# EAGLE design ROM_1_0 (EAGLE 8.3.2)
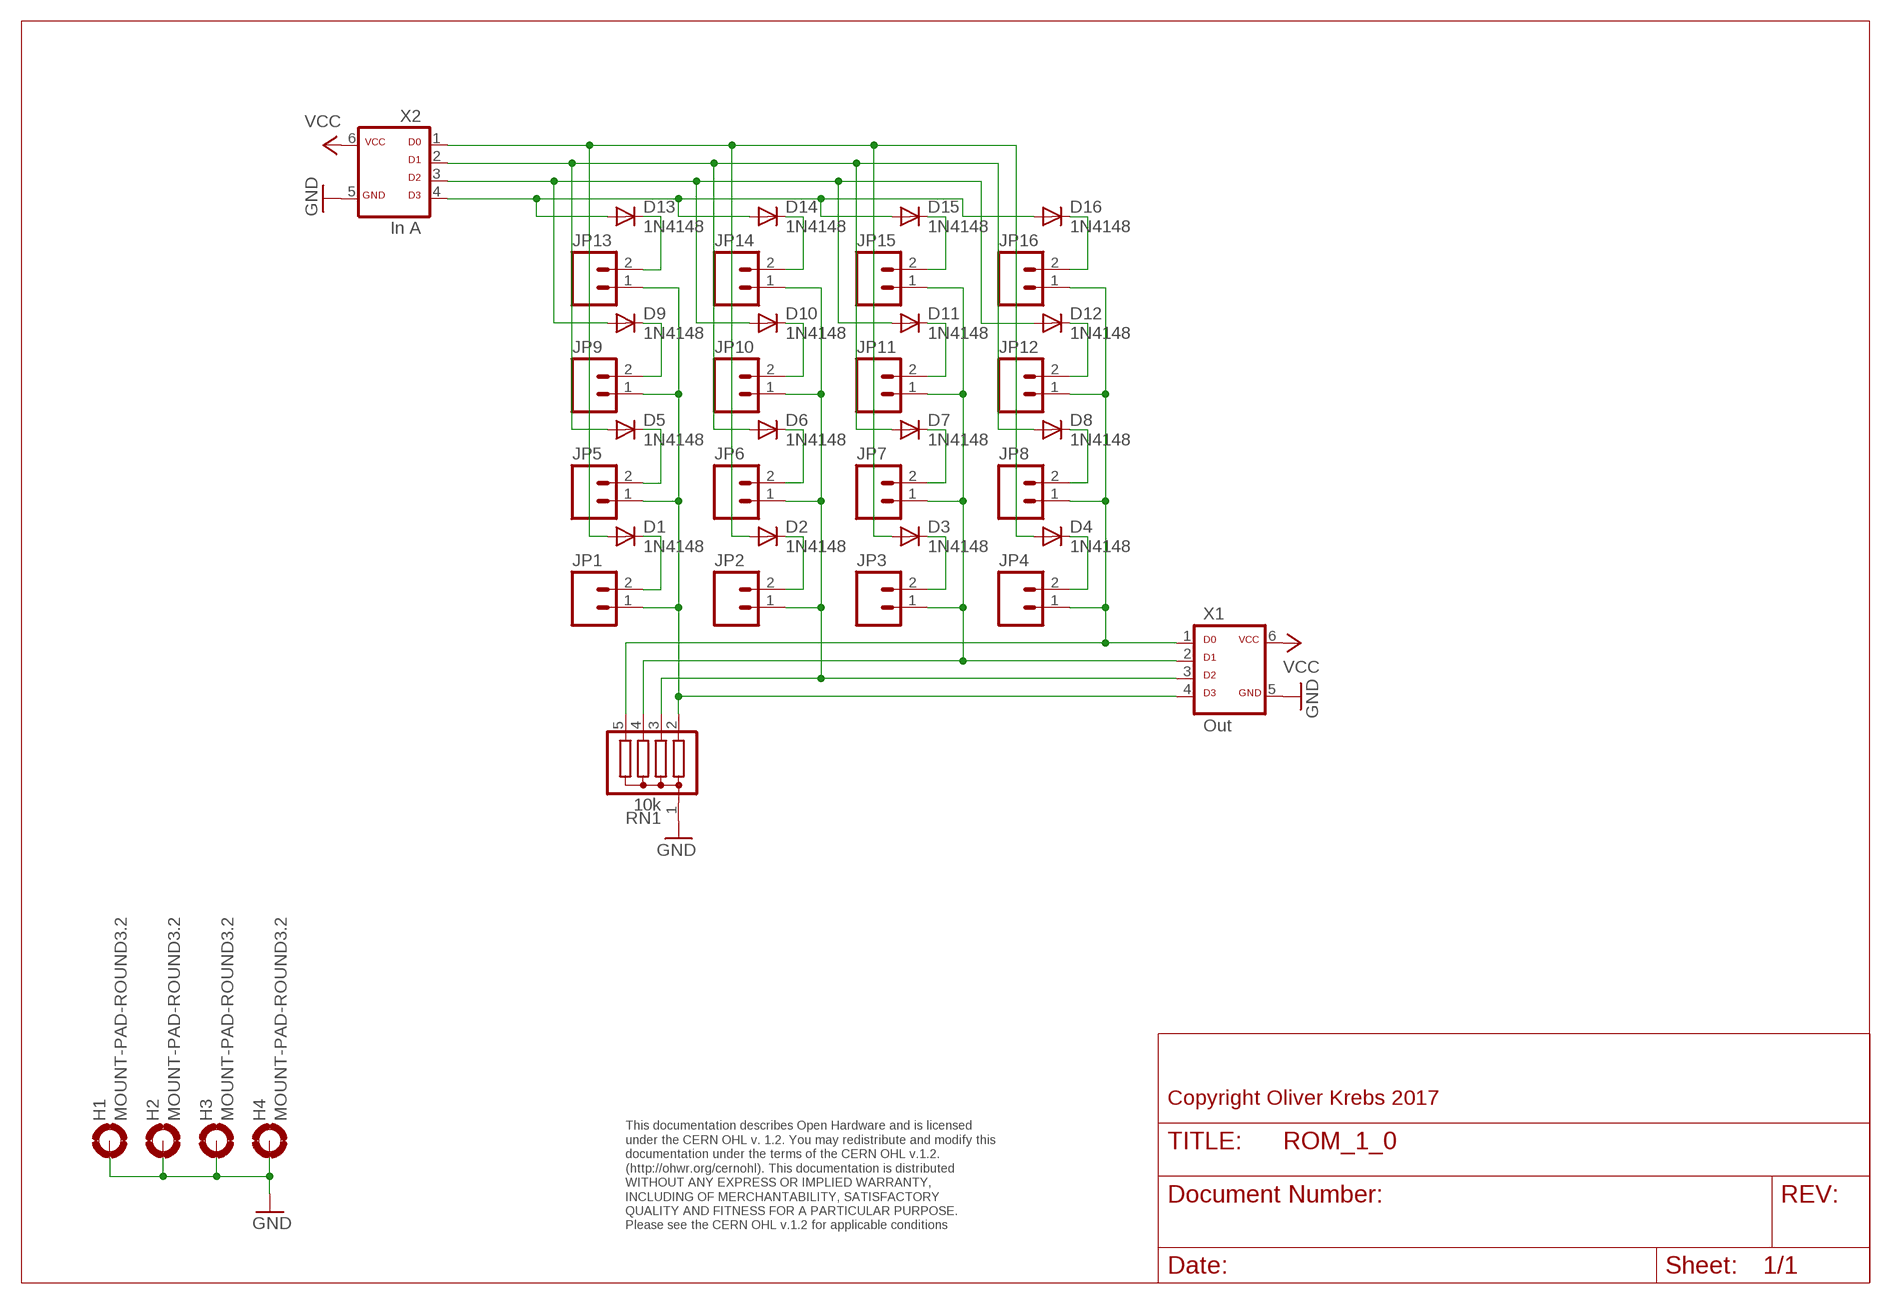
[diagram p0: schematic, sheet 1]

## Parts
D1  1N4148  1N4148DO35-7  [DO35-7]
D2  1N4148  1N4148DO35-7  [DO35-7]
D3  1N4148  1N4148DO35-7  [DO35-7]
D4  1N4148  1N4148DO35-7  [DO35-7]
D5  1N4148  1N4148DO35-7  [DO35-7]
D6  1N4148  1N4148DO35-7  [DO35-7]
D7  1N4148  1N4148DO35-7  [DO35-7]
D8  1N4148  1N4148DO35-7  [DO35-7]
D9  1N4148  1N4148DO35-7  [DO35-7]
D10  1N4148  1N4148DO35-7  [DO35-7]
D11  1N4148  1N4148DO35-7  [DO35-7]
D12  1N4148  1N4148DO35-7  [DO35-7]
D13  1N4148  1N4148DO35-7  [DO35-7]
D14  1N4148  1N4148DO35-7  [DO35-7]
D15  1N4148  1N4148DO35-7  [DO35-7]
D16  1N4148  1N4148DO35-7  [DO35-7]
H1  MOUNT-PAD-ROUND3.2  [3,2-PAD]
H2  MOUNT-PAD-ROUND3.2  [3,2-PAD]
H3  MOUNT-PAD-ROUND3.2  [3,2-PAD]
H4  MOUNT-PAD-ROUND3.2  [3,2-PAD]
JP1  M02PTH  [1X02]
JP2  M02PTH  [1X02]
JP3  M02PTH  [1X02]
JP4  M02PTH  [1X02]
JP5  M02PTH  [1X02]
JP6  M02PTH  [1X02]
JP7  M02PTH  [1X02]
JP8  M02PTH  [1X02]
JP9  M02PTH  [1X02]
JP10  M02PTH  [1X02]
JP11  M02PTH  [1X02]
JP12  M02PTH  [1X02]
JP13  M02PTH  [1X02]
JP14  M02PTH  [1X02]
JP15  M02PTH  [1X02]
JP16  M02PTH  [1X02]
RN1  10k  G04R  [SIL5]
X1  Out  ML6D  [ML-6]
X2  In A  ML6D  [ML-6]

## Nets
GND: H1.B3,2(MOUNT) H2.B3,2(MOUNT) H3.B3,2(MOUNT) H4.B3,2(MOUNT) RN1.1 X1.5 X2.5
N$1: JP4.1 JP8.1 JP12.1 JP16.1 RN1.5 X1.1
N$2: JP3.1 JP7.1 JP11.1 JP15.1 RN1.4 X1.2
N$3: JP2.1 JP6.1 JP10.1 JP14.1 RN1.3 X1.3
N$4: JP1.1 JP5.1 JP9.1 JP13.1 RN1.2 X1.4
N$5: D1.A D2.A D3.A D4.A X2.1
N$6: D1.C JP1.2
N$7: D2.C JP2.2
N$8: D3.C JP3.2
N$9: D4.C JP4.2
N$10: D5.A D6.A D7.A D8.A X2.2
N$11: D6.C JP6.2
N$12: D7.C JP7.2
N$14: D5.C JP5.2
N$15: D8.C JP8.2
N$16: D9.C JP9.2
N$17: D10.C JP10.2
N$18: D11.C JP11.2
N$19: D12.C JP12.2
N$20: D9.A D10.A D11.A D12.A X2.3
N$21: D13.A D14.A D15.A D16.A X2.4
N$22: D13.C JP13.2
N$23: D14.C JP14.2
N$24: D15.C JP15.2
N$25: D16.C JP16.2
VCC: X1.6 X2.6

## Notes on the sheet
- Copyright Oliver Krebs 2017
- This documentation describes Open Hardware and is licensed 
  under the CERN OHL v. 1.2. You may redistribute and modify this 
  documentation under the terms of the CERN OHL v.1.2. 
  (http://ohwr.org/cernohl). This documentation is distributed
  WITHOUT ANY EXPRESS OR IMPLIED WARRANTY, 
  INCLUDING OF MERCHANTABILITY, SATISFACTORY 
  QUALITY AND FITNESS FOR A PARTICULAR PURPOSE. 
  Please see the CERN OHL v.1.2 for applicable conditions

## Library data of the parts
D1-D16 = 01-my-diode:1N4148: DIODE high speed (Philips)
H1-H4 = holes:MOUNT-PAD-ROUND: MOUNTING PAD, round
JP1-JP16 = SparkFun-Connectors:M02: Standard 2-pin 0.1" header. Use with - straight break away headers ( PRT-00116) - right angle break away headers (PRT-00553) - swiss pins (PRT-00743) - machine pins (PRT-00117) - female headers (PRT-00115) Molex polarized connector foot print use with: PRT-08233 with associated crimp pins and housings. 2.54_SCREWTERM for use with PRT-10571. 3.5mm Screw Terminal footprints for PRT-08084 5mm Screw Terminal footprints for use with PRT-08432
RN1 = resistor-sil:G04R: SIL RESISTOR; OC_FARNELL: unknown; OC_NEWARK: unknown
X1 X2 = 01-my-con:ML6D

## Board
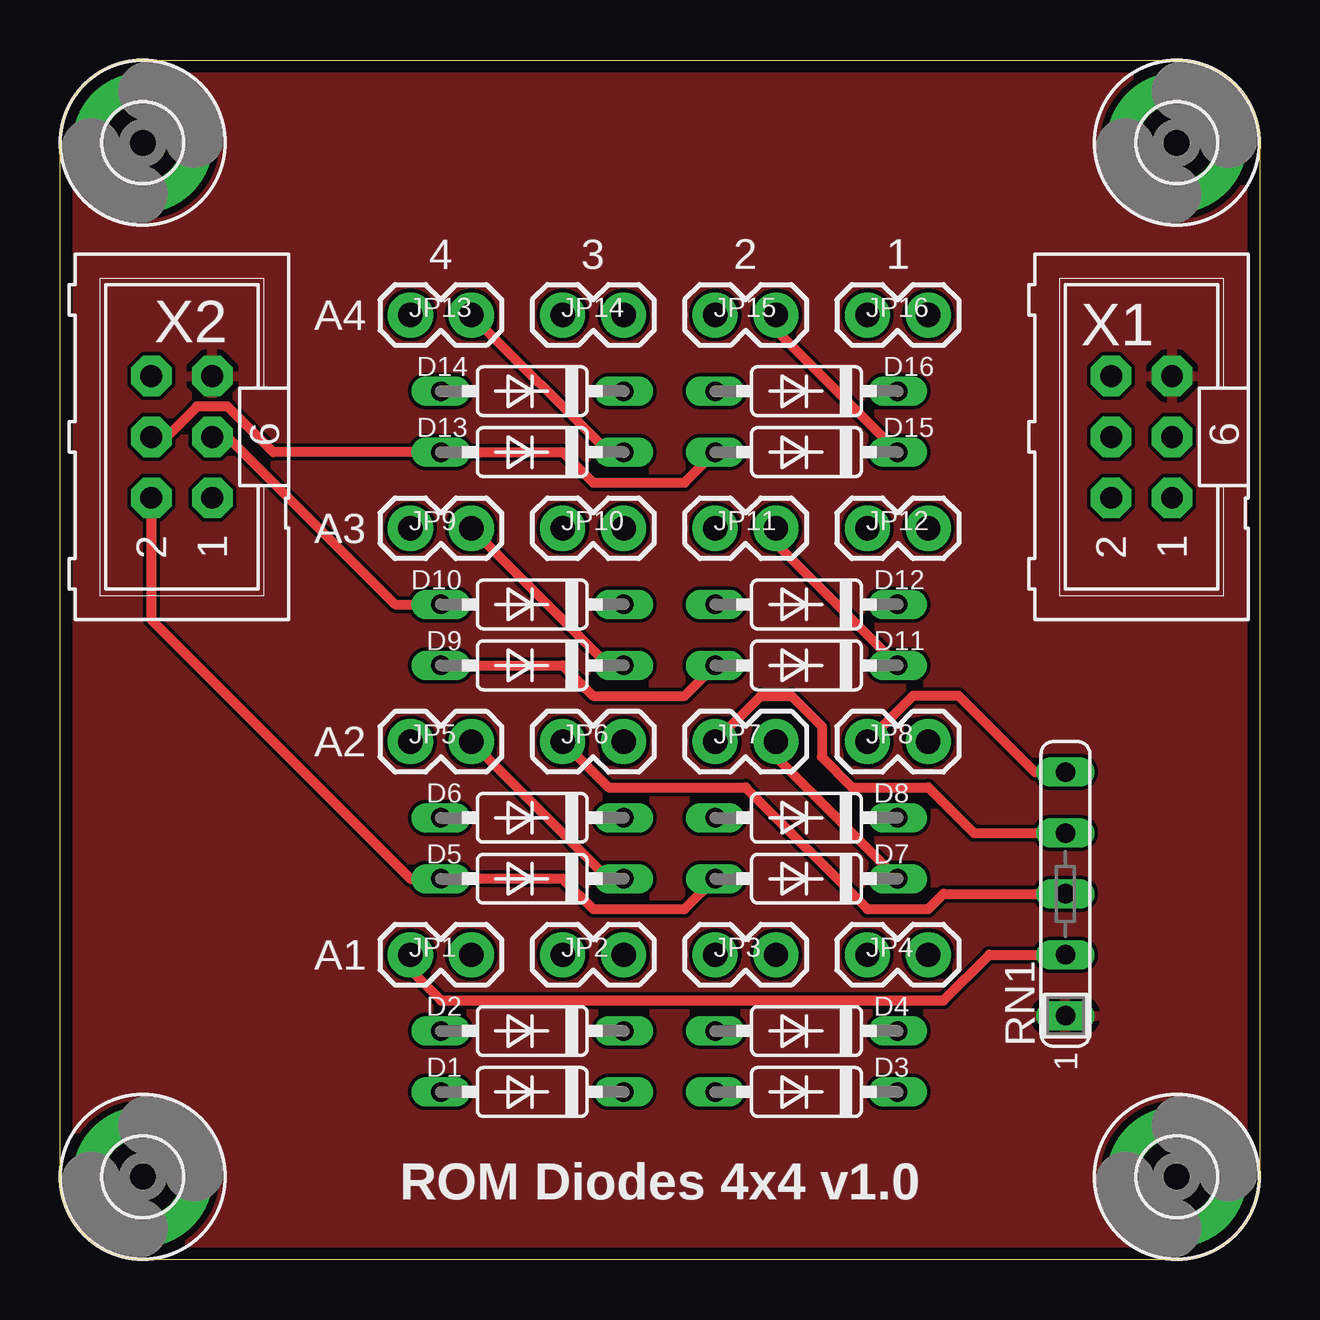
[diagram p1: board, top side]
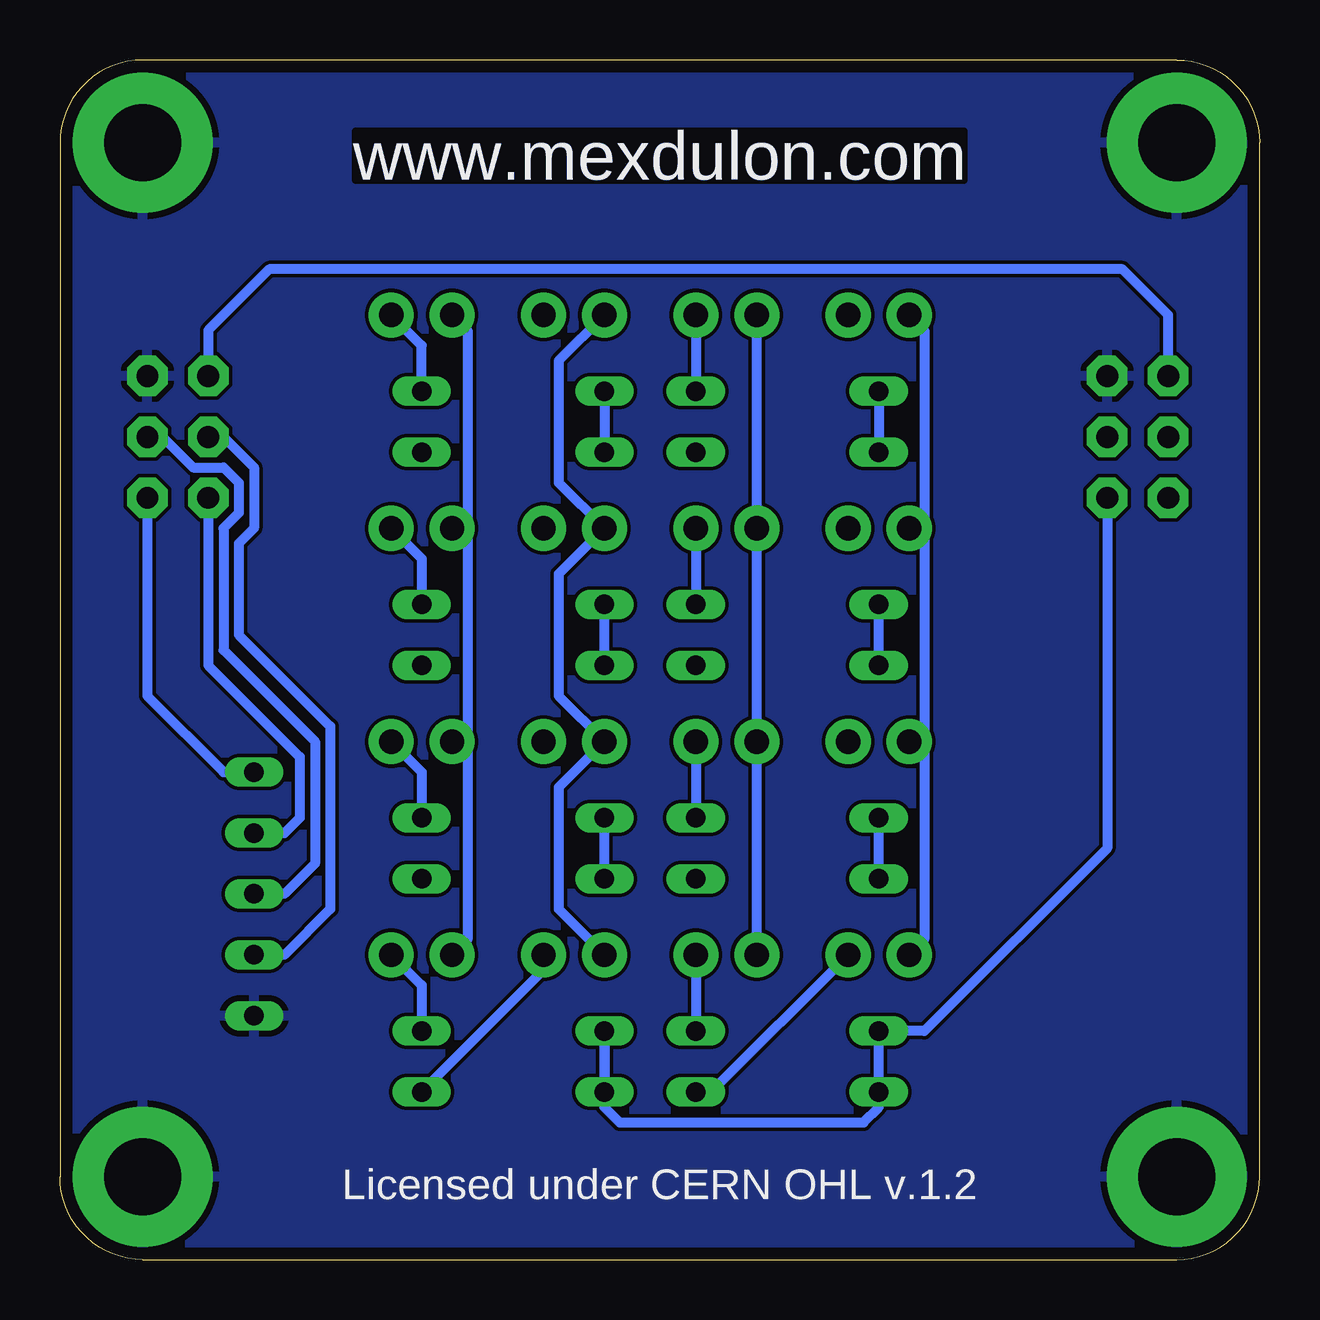
[diagram p2: board, bottom side, seen from below]

Size 50 x 50 mm. Coordinates in mm from the lower left corner, seen from the top.
Outline: 0,3.45 0,46.55 arc-90 3.45,50 46.55,50 arc-90 50,46.55 50,3.45 arc-90 46.55,0 3.45,0 arc-90 0,3.45
Copper layers (1*16): Top 0.035mm / dielectric 1.6mm / Bottom 0.035mm
Design rules "Elecrow_2-layer_PCB_eagle_rule": minimum track width 6mil, minimum drill 12mil, track to track 6mil, track to pad 6mil, pad to pad 6mil, via to via 8mil, smd to smd 0mil, copper to edge 20mil, drill to drill 10mil, minimum pad ring 6mil, minimum via ring 6mil, stop-mask expansion 0mil, vias tented up to drill 100mil, thermal gap 10mil

### Footprints (pad centres in the part's own frame; a part is rotated, then mirrored left to right if it is on the bottom)
DO35-7 = drill 0.813 long: A 3.81,0; C -3.81,0
3,2-PAD = drill 3.2 pad 5.842: B3,2 0,0
1X02 = drill 1.016 pad 1.88: 1 0,0; 2 2.54,0
SIL5 = drill 0.813 long: 1 -5.08,0; 2 -2.54,0; 3 0,0; 4 2.54,0; 5 5.08,0
ML-6 = drill 0.914 pad 1.676 octagon: 1 -2.54,-1.27; 2 -2.54,1.27; 3 0,-1.27; 4 0,1.27; 5 2.54,-1.27; 6 2.54,1.27

### Placement (x,y rotation side)
D1  19.68,6.99 180 top
D2  19.68,9.53 180 top
D3  31.11,6.99 180 top
D4  31.11,9.53 180 top
D5  19.68,15.88 180 top
D6  19.68,18.41 180 top
D7  31.11,15.88 180 top
D8  31.11,18.41 180 top
D9  19.68,24.77 180 top
D10  19.68,27.3 180 top
D11  31.11,24.77 180 top
D12  31.11,27.3 180 top
D13  19.68,33.66 180 top
D14  19.68,36.2 180 top
D15  31.11,33.66 180 top
D16  31.11,36.2 180 top
H1  3.45,3.45 0 top
H2  3.45,46.55 0 top
H3  46.55,3.45 0 top
H4  46.55,46.55 0 top
JP1  14.61,12.7 0 top
JP2  20.95,12.7 0 top
JP3  27.3,12.7 0 top
JP4  33.66,12.7 0 top
JP5  14.61,21.59 0 top
JP6  20.95,21.59 0 top
JP7  27.3,21.59 0 top
JP8  33.66,21.59 0 top
JP9  14.61,30.48 0 top
JP10  20.95,30.48 0 top
JP11  27.3,30.48 0 top
JP12  33.66,30.48 0 top
JP13  14.61,39.37 0 top
JP14  20.95,39.37 0 top
JP15  27.3,39.37 0 top
JP16  33.66,39.37 0 top
RN1  41.91,15.24 90 top
X1  45.09,34.29 90 top
X2  5.08,34.29 90 top

### Tracks (layer width: path | path; a pad name or v marks a point on that pad's centre or on a via)
GND
  pour Bottom: 0,0 50.8,0 50.8,50.8 0,50.8
  pour Top: 0,50.16 50.16,50.16 50.16,0 0,0
N$1
  Top 0.406: RN1.5 40.64,20.32 37.47,23.5 35.56,23.5 JP8.1
  Bottom 0.406: 33.02,30.48 33.02,21.59 | 33.02,21.59 33.02,13.34 JP4.1 | JP8.1 33.02,21.59 | JP12.1 33.02,30.48 | X1.1 46.35,23.5 43.18,20.32 RN1.5 | JP16.1 33.02,38.73 33.02,30.48
N$2
  Top 0.406: JP7.1 29.21,23.5 30.48,23.5 31.75,22.23 31.75,20.95 33.02,19.68 36.2,19.68 38.1,17.78 RN1.4
  Bottom 0.406: JP3.1 29.21,14.61 29.21,19.68 JP7.1 29.21,23.5 29.21,28.57 JP11.1 29.21,32.38 29.21,37.47 JP15.1 | X1.2 43.81,24.77 40.01,20.95 40.01,18.41 40.64,17.78 RN1.4
N$3
  Top 0.406: JP6.1 22.86,19.68 28.57,19.68 33.66,14.61 36.2,14.61 36.83,15.24 RN1.3
  Bottom 0.406: JP2.1 JP6.1 JP10.1 JP14.1 | X1.3 45.72,34.29 44.45,33.02 43.18,33.02 42.55,32.38 42.55,31.11 43.18,30.48 43.18,25.4 39.37,21.59 39.37,16.51 40.64,15.24 RN1.3
N$4
  Top 0.406: RN1.2 38.73,12.7 36.83,10.79 15.88,10.79 14.61,12.06 JP1.1
  Bottom 0.406: 13.97,30.48 13.97,21.59 | 13.97,21.59 13.97,13.34 JP1.1 | JP5.1 13.97,21.59 | JP9.1 13.97,30.48 | X1.4 43.18,34.29 41.91,33.02 41.91,30.48 42.55,29.84 42.55,26.04 38.73,22.23 38.73,14.61 40.64,12.7 RN1.2 | JP13.1 13.97,38.73 13.97,30.48
N$5
  Bottom 0.406: D3.A D4.A 27.3,6.35 26.67,5.71 16.51,5.71 15.88,6.35 D1.A D2.A 13.97,9.53 6.35,17.14 X2.1
N$6
  Bottom 0.406: D1.C 22.86,6.99 JP1.2
N$7
  Bottom 0.406: JP2.2 D2.C
N$8
  Bottom 0.406: JP3.2 29.84,12.06 D3.C
N$9
  Bottom 0.406: JP4.2 34.92,11.43 D4.C
N$10
  Top 0.406: D7.A 26.04,14.61 22.23,14.61 20.95,15.88 D5.A 14.61,15.88 3.81,26.67 X2.2
  Bottom 0.406: D7.A D8.A | D5.A D6.A
N$11
  Bottom 0.406: JP6.2 D6.C
N$12
  Top 0.406: JP7.2 29.84,20.95 D7.C
N$14
  Top 0.406: JP5.2 22.86,15.88 D5.C
N$15
  Bottom 0.406: JP8.2 34.92,20.32 D8.C
N$16
  Top 0.406: JP9.2 22.86,24.77 D9.C
N$17
  Bottom 0.406: JP10.2 D10.C
N$18
  Top 0.406: JP11.2 29.84,29.84 D11.C
N$19
  Bottom 0.406: JP12.2 34.92,29.21 D12.C
N$20
  Top 0.406: X2.3 6.99,34.29 13.97,27.3 D10.A | D9.A 20.95,24.77 22.23,23.5 26.04,23.5 D11.A
  Bottom 0.406: D9.A D10.A | D11.A D12.A
N$21
  Top 0.406: D15.A 26.04,32.38 22.23,32.38 20.95,33.66 D13.A 8.89,33.66 6.99,35.56 5.71,35.56 4.45,34.29 X2.4
  Bottom 0.406: D16.A D15.A | D14.A D13.A
N$22
  Top 0.406: D13.C 22.86,33.66 JP13.2
N$23
  Bottom 0.406: JP14.2 D14.C
N$24
  Top 0.406: JP15.2 29.84,38.73 D15.C
N$25
  Bottom 0.406: D16.C 34.92,38.1 JP16.2
VCC
  Bottom 0.406: X2.6 3.81,39.37 5.71,41.27 41.27,41.27 43.81,38.73 X1.6

### Text on the board
Bottom: www.mexdulon.com
tNames: 4 | 3 | 2 | 1 | A4 | A3 | A2 | A1 | ROM Diodes 4x4 v1.0
bNames: www.mexdulon.com | Licensed under CERN OHL v.1.2